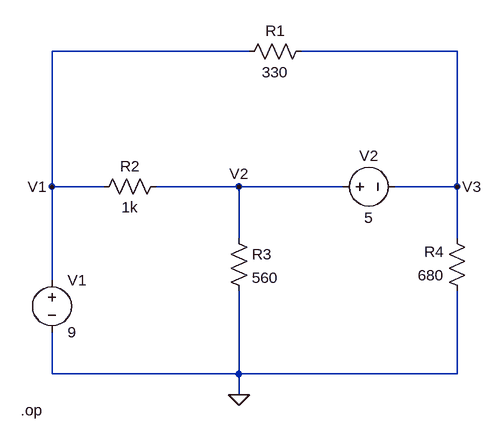
[diagram p0: schematic sim1.asc]
sim1.asc, the LTspice schematic file:
Version 4
SHEET 1 880 680
WIRE 192 -144 -112 -144
WIRE 512 -144 272 -144
WIRE 512 16 512 -144
WIRE -112 64 -112 -144
WIRE -32 64 -112 64
WIRE 176 64 48 64
WIRE 336 64 176 64
WIRE 512 64 512 16
WIRE 512 64 416 64
WIRE -112 96 -112 64
WIRE 176 144 176 64
WIRE 512 144 512 64
WIRE -112 208 -112 96
WIRE -112 352 -112 288
WIRE 176 352 176 224
WIRE 176 352 -112 352
WIRE 512 352 512 224
WIRE 512 352 176 352
WIRE 176 384 176 352
FLAG 176 384 0
FLAG 512 64 V3
FLAG 176 64 V2
FLAG -112 64 V1
DATAFLAG 224 -192 "round(1meg*I(R1))/1meg"
DATAFLAG 0 16 "I(R2)"
DATAFLAG 368 -32 "round(1meg*(I(V2)*(V(v2)-V(v3))))/1meg"
DATAFLAG 240 240 "round(1meg*I(R3))/1meg"
DATAFLAG 592 240 "I(R4)"
DATAFLAG 0 240 "round(1meg*I(V1))/1meg"
DATAFLAG -112 96 "V(v1)"
DATAFLAG 176 32 "round(1k*V(v2))/1k"
DATAFLAG 512 16 "round(1k*V(v3))/1k"
DATAFLAG 0 272 "round(1meg*(V(v1)*I(v1)))/1meg"
DATAFLAG 240 272 "round(1meg*(I(R3)*I(R3)*(V(v2)/I(R3))))/1meg"
DATAFLAG 0 -16 "round(1000meg*(I(R2)*I(R2)*((V(v1)-V(v2))/I(R2))))/1000meg"
DATAFLAG 224 -224 "round(-1meg*(I(R1)*I(R1)*((V(v1)-V(v3))/I(R1))))/1meg"
DATAFLAG 368 0 "round(1meg*I(v2))/1meg"
DATAFLAG 576 272 "round(-1meg*(I(R4)*I(R4)*(V(v3)/I(R4))))/1meg"
SYMBOL voltage -112 192 R0
WINDOW 123 0 0 Left 2
WINDOW 39 0 0 Left 2
SYMATTR InstName V1
SYMATTR Value 9
SYMBOL res 160 128 R0
SYMATTR InstName R3
SYMATTR Value 560
SYMATTR SpiceLine tol=10 pwr=0.5
SYMBOL res 528 240 R180
WINDOW 0 36 76 Left 2
WINDOW 3 36 40 Left 2
SYMATTR InstName R4
SYMATTR Value 680
SYMATTR SpiceLine tol=10 pwr=0.5
SYMBOL res -48 80 R270
WINDOW 0 32 56 VTop 2
WINDOW 3 0 56 VBottom 2
SYMATTR InstName R2
SYMATTR Value 1k
SYMATTR SpiceLine tol=10 pwr=0.5
SYMBOL res 288 -160 R90
WINDOW 0 0 56 VBottom 2
WINDOW 3 32 56 VTop 2
SYMATTR InstName R1
SYMATTR Value 330
SYMATTR SpiceLine tol=10 pwr=0.5
SYMBOL voltage 320 64 R270
WINDOW 0 32 56 VTop 2
WINDOW 3 -32 56 VBottom 2
WINDOW 123 0 0 Left 2
WINDOW 39 0 0 Left 2
SYMATTR InstName V2
SYMATTR Value 5
TEXT -160 408 Left 2 !.op

The netlist it stands for:
* sim1.asc
V1 V1 0 9
R3 V2 0 560 tol=10 pwr=0.5
R4 0 V3 680 tol=10 pwr=0.5
R2 V1 V2 1k tol=10 pwr=0.5
R1 V3 V1 330 tol=10 pwr=0.5
V2 V2 V3 5
.op
.backanno
.end